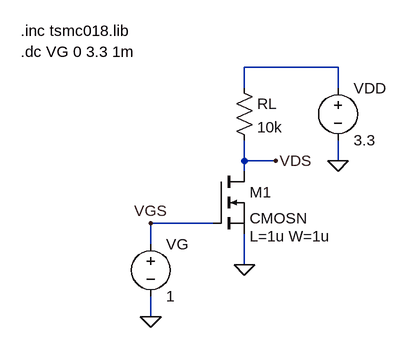
[diagram p0: schematic q1_a.asc]
q1_a.asc, the LTspice schematic file:
Version 4.1
SHEET 1 880 680
WIRE 368 32 224 32
WIRE 224 64 224 32
WIRE 368 64 368 32
WIRE 224 176 224 144
WIRE 272 176 224 176
WIRE 368 176 368 144
WIRE 224 192 224 176
WIRE 176 272 80 272
WIRE 80 304 80 272
WIRE 224 336 224 288
WIRE 80 416 80 384
FLAG 368 176 0
FLAG 224 336 0
FLAG 80 272 VGS
FLAG 272 176 VDS
FLAG 80 416 0
SYMBOL nmos 176 192 R0
WINDOW 123 56 100 Left 2
SYMATTR Value2 L=1u W=1u
SYMATTR InstName M1
SYMATTR Value CMOSN
SYMBOL voltage 368 48 R0
WINDOW 123 0 0 Left 0
WINDOW 39 0 0 Left 0
SYMATTR InstName VDD
SYMATTR Value 3.3
SYMBOL res 208 48 R0
SYMATTR InstName RL
SYMATTR Value 10k
SYMBOL voltage 80 288 R0
WINDOW 123 0 0 Left 0
WINDOW 39 0 0 Left 0
SYMATTR InstName VG
SYMATTR Value 1
TEXT -120 -24 Left 2 !.inc tsmc018.lib
TEXT -120 8 Left 2 !.dc VG 0 3.3 1m

The netlist it stands for:
* q1_a.asc
M1 VDS VGS 0 0 CMOSN L=1u W=1u
VDD N001 0 3.3
RL N001 VDS 10k
VG VGS 0 1
.model NMOS NMOS
.model PMOS PMOS
.lib standard.mos
.inc tsmc018.lib
.dc VG 0 3.3 1m
.backanno
.end

* Results of the author's LTspice run, read from the files saved beside the schematic
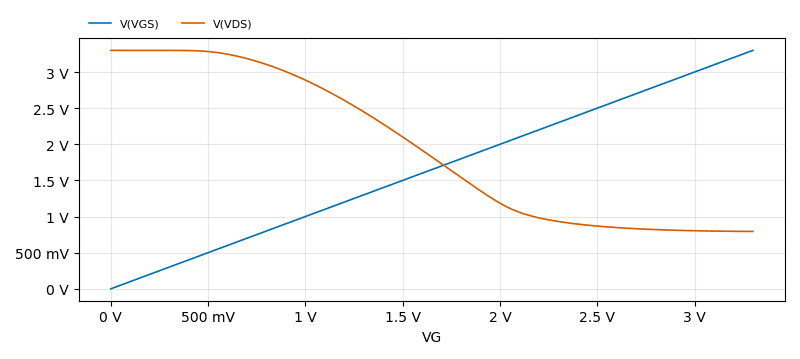
[diagram p1: DC transfer characteristic of q1_a.asc, plotted from the saved traces]
* DC transfer characteristic, 1 run:
*   V(VGS): 0 V at VG=0 V, 3.3 V at VG=3.3 V, min 0 V, max 3.3 V
*   V(VDS): 3.3 V at VG=0 V, 794.1 mV at VG=3.3 V, min 794.1 mV, max 3.3 V